# EAGLE board PCB-CMB-5-SHLD (EAGLE 7.1.0)
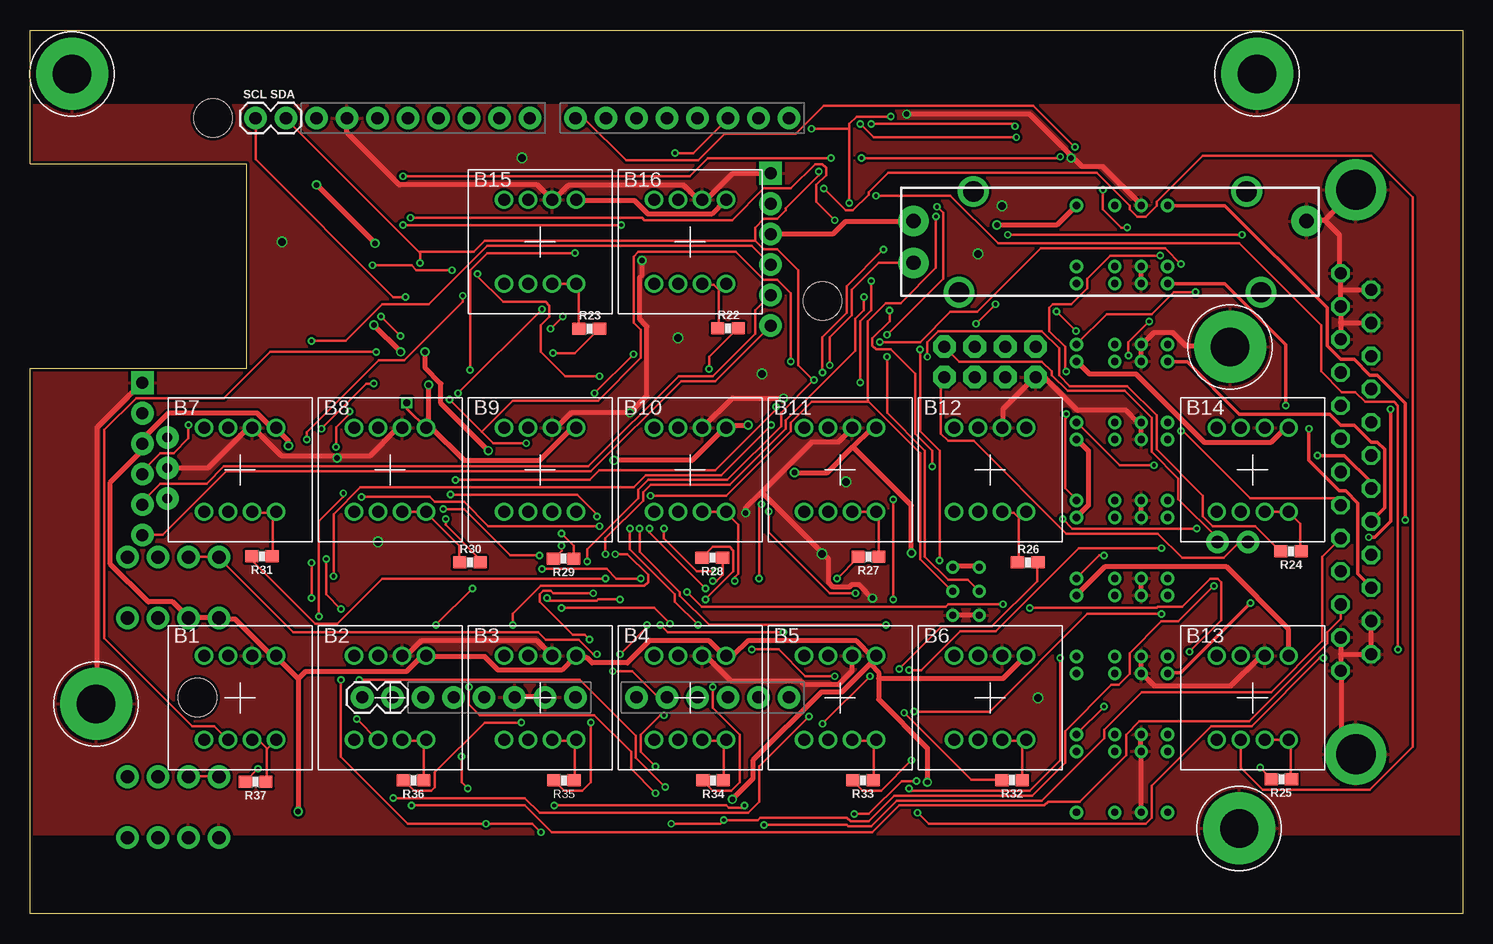
[diagram p3: board, top side]
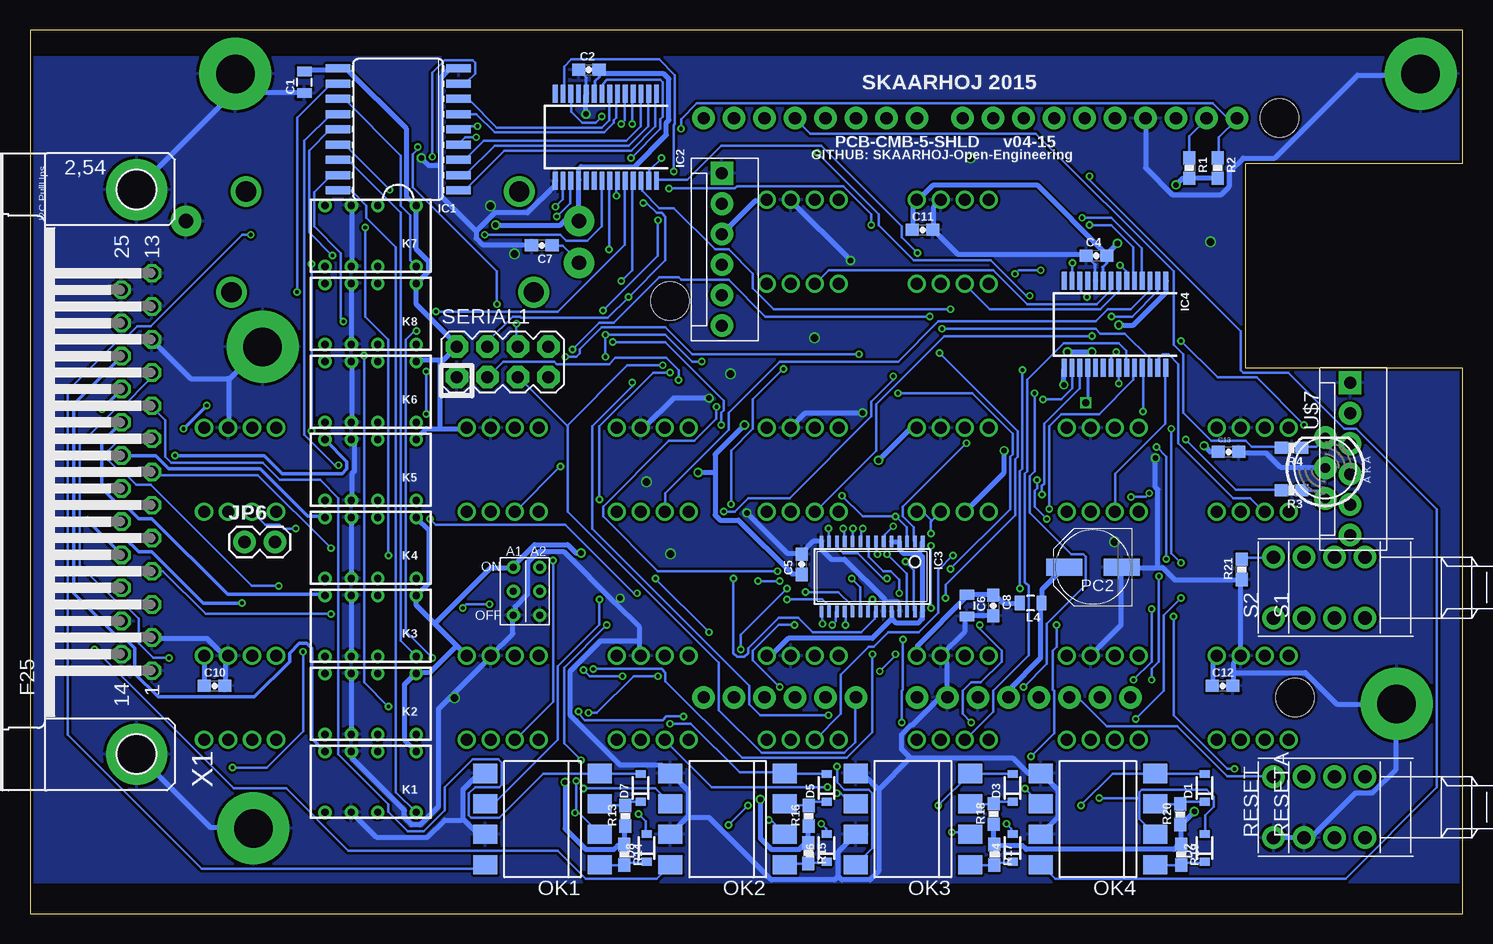
[diagram p4: board, bottom side, seen from below]

Size 119.38 x 73.66 mm. Coordinates in mm from the lower left corner, seen from the top.
Outline: 0,0 0,45.47 18.05,45.47 18.05,62.5 0,62.5 0,73.66 119.38,73.66 119.38,0 0,0
Copper layers (1*16): Top 0.035mm / dielectric 1.5mm / Bottom 0.035mm
Design rules "Fusion_eagle_rule_v1.1": minimum track width 6mil, minimum drill 12mil, track to track 6mil, track to pad 6mil, pad to pad 6mil, via to via 6mil, smd to smd 0mil, copper to edge 10mil, drill to drill 10mil, minimum pad ring 10mil, minimum via ring 6mil, stop-mask expansion 2mil, vias tented up to drill 100mil, thermal gap 10mil
Net classes: 0 default: width 0.203 mm, drill 0.305 mm, clearance 0.203 mm; 1 Power: width 0.406 mm, drill 0.457 mm, clearance 0.203 mm; 2 RELAY LINES: width 0.305 mm, drill 0.305 mm, clearance 0.203 mm; 3 INput lines: width 0.203 mm, drill 0.305 mm, clearance 0.203 mm
Holes 3.2 mm at 66.04,51.07 15.24,66.31 13.97,18.05
tRestrict: area 0,0 to 120,6.5; area 0,67.5 to 120,74
bRestrict: area 0,71.5 to 120,74; area 0,0 to 120,2.5

## Footprints (pad centres in the part's own frame; a part is rotated, then mirrored left to right if it is on the bottom)
NKK-NP01 = drill 1: 1 1,3.5; 2 -1,-3.5; L1 3,-3.5; L2 1,-3.5; L3 -1,3.5; L4 -3,3.5; LC1 3,3.5; LC2 -3,-3.5
0805 = smd 0.8 x 1.2: 1 -0.9,0; 2 0.9,0
0603-CAP = smd 1.1 x 1: 1 -0.85,0; 2 0.85,0
SOD-323 = smd 0.63 x 0.83: 1 -1.15,0; 2 1.15,0
DUEMILANOVE_VIAS = drill 1.016 pad 1.88: 3.3V 50.8,13.97; 5V 50.8,16.51; A0 50.8,29.21; A1 50.8,31.75; A2 50.8,34.29; A3 50.8,36.83; A4 50.8,39.37; A5 50.8,41.91; AREF 2.54,2.54; D2 2.54,36.83; D3 2.54,34.29; D4 2.54,31.75; D5 2.54,29.21; D6 2.54,26.67; D7 2.54,24.13; D8 2.54,20.32; D9 2.54,17.78; D10 2.54,15.24; D11 2.54,12.7; D12 2.54,10.16; D13 2.54,7.62; GND@0 50.8,19.05; GND@1 50.8,21.59; GND@2 2.54,5.08; RES 50.8,11.43; RX 2.54,41.91; TX 2.54,39.37; VIN 50.8,24.13
SO18W = smd 0.66 x 2.032: 1 -5.08,-5.029; 2 -3.81,-5.029; 3 -2.54,-5.029; 4 -1.27,-5.029; 5 0,-5.029; 6 1.27,-5.029; 7 2.54,-5.029; 8 3.81,-5.029; 9 5.08,-5.029; 10 5.08,5.029; 11 3.81,5.029; 12 2.54,5.029; 13 1.27,5.029; 14 0,5.029; 15 -1.27,5.029; 16 -2.54,5.029; 17 -3.81,5.029; 18 -5.08,5.029
SSOP28 = smd 0.4 x 1.5: 1 -4.225,-3.625; 2 -3.575,-3.625; 3 -2.925,-3.625; 4 -2.275,-3.625; 5 -1.625,-3.625; 6 -0.975,-3.625; 7 -0.325,-3.625; 8 0.325,-3.625; 9 0.975,-3.625; 10 1.625,-3.625; 11 2.275,-3.625; 12 2.925,-3.625; 13 3.575,-3.625; 14 4.225,-3.625; 15 4.225,3.625; 16 3.575,3.625; 17 2.925,3.625; 18 2.275,3.625; 19 1.625,3.625; 20 0.975,3.625; 21 0.325,3.625; 22 -0.325,3.625; 23 -0.975,3.625; 24 -1.625,3.625; 25 -2.275,3.625; 26 -2.925,3.625; 27 -3.575,3.625; 28 -4.225,3.625
TSSOP28 = smd 0.305 x 0.991: 1 -4.225,-2.918; 2 -3.575,-2.918; 3 -2.925,-2.918; 4 -2.275,-2.918; 5 -1.625,-2.918; 6 -0.975,-2.918; 7 -0.325,-2.918; 8 0.325,-2.918; 9 0.975,-2.918; 10 1.625,-2.918; 11 2.275,-2.918; 12 2.925,-2.918; 13 3.575,-2.918; 14 4.225,-2.918; 15 4.225,2.918; 16 3.575,2.918; 17 2.925,2.918; 18 2.275,2.918; 19 1.625,2.918; 20 0.975,2.918; 21 0.325,2.918; 22 -0.325,2.918; 23 -0.975,2.918; 24 -1.625,2.918; 25 -2.275,2.918; 26 -2.925,2.918; 27 -3.575,2.918; 28 -4.225,2.918
1X02 = drill 1.016 pad 1.88: 1 0,0; 2 2.54,0
MOLEX-1X6 = drill 1.016 pad 1.88 square: 1 0,0 | drill 1.016 pad 1.88: 2 2.54,0; 3 5.08,0; 4 7.62,0; 5 10.16,0; 6 12.7,0
DS2Y = drill 0.6: 1 1.2,0.46; 16 1.2,5.54; O1 4.4,0.46; O2 4.4,5.54; P1 6.6,0.46; P2 6.6,5.54; S1 8.8,0.46; S2 8.8,5.54
DIL8-SMD = smd 1.6 x 2: 1 -3.81,-4.77; 2 -1.27,-4.77; 3 1.27,-4.77; 4 3.81,-4.77; 5 3.81,4.77; 6 1.27,4.77; 7 -1.27,4.77; 8 -3.81,4.77
PANASONIC_D = smd 3 x 1.4: + 2.4,0; - -2.4,0
SLIDER20 = drill 1.194 pad 2.54: 1 -16.383,1.74; 2A -16.383,-1.74; 3 16.383,1.74 | drill 1.702: P$1 -11.392,4.191; P$2 11.392,4.191; P$3 12.598,-4.191; P$4 -12.598,-4.191
0603-RES = smd 1.1 x 1: 1 -0.85,0; 2 0.85,0
PUSHBUTTON = drill 1.1 pad 1.88: 1 2.54,2.54; 2 2.54,-2.54; 3 -2.54,2.54; 4 -2.54,-2.54
2X4 = drill 1.016 pad 1.88 octagon: 1 -3.81,-1.27; 2 -3.81,1.27; 3 -1.27,-1.27; 4 -1.27,1.27; 5 1.27,-1.27; 6 1.27,1.27; 7 3.81,-1.27; 8 3.81,1.27
3.2MMPAD6MM = drill 3.2 pad 6: P$1 0,0
LED5MM-BICOLOR = drill 0.813 pad 1.88: A2 2.54,0; A3 -2.54,0; K1 0,0
2BITADDR = drill 0.6: A1 0,0; A2 2.2,0; H2 0,2; H3 2.2,2; L2 0,-2; L3 2.2,-2
F25HP = drill 1.016 octagon: 1 -16.561,-1.27; 2 -13.792,-1.27; 3 -11.049,-1.27; 4 -8.28,-1.27; 5 -5.512,-1.27; 6 -2.769,-1.27; 7 0,-1.27; 8 2.769,-1.27; 9 5.512,-1.27; 10 8.28,-1.27; 11 11.049,-1.27; 12 13.792,-1.27; 13 16.561,-1.27; 14 -15.189,1.27; 15 -12.421,1.27; 16 -9.652,1.27; 17 -6.909,1.27; 18 -4.14,1.27; 19 -1.372,1.27; 20 1.372,1.27; 21 4.14,1.27; 22 6.909,1.27; 23 9.652,1.27; 24 12.421,1.27; 25 15.189,1.27 | drill 3.302 pad 5.08: G1 -23.52,0; G2 23.52,0

## Placement (x,y rotation side)
B1  NKK-NP01-SINGLECOLOR  [NKK-NP01]  17.5,18 0 top
B2  NKK-NP01-SINGLECOLOR  [NKK-NP01]  30,18 0 top
B3  NKK-NP01-SINGLECOLOR  [NKK-NP01]  42.5,18 0 top
B4  NKK-NP01-SINGLECOLOR  [NKK-NP01]  55,18 0 top
B5  NKK-NP01-SINGLECOLOR  [NKK-NP01]  67.5,18 0 top
B6  NKK-NP01-SINGLECOLOR  [NKK-NP01]  80,18 0 top
B7  NKK-NP01-SINGLECOLOR  [NKK-NP01]  17.5,37 0 top
B8  NKK-NP01-SINGLECOLOR  [NKK-NP01]  30,37 0 top
B9  NKK-NP01-SINGLECOLOR  [NKK-NP01]  42.5,37 0 top
B10  NKK-NP01-SINGLECOLOR  [NKK-NP01]  55,37 0 top
B11  NKK-NP01-SINGLECOLOR  [NKK-NP01]  67.5,37 0 top
B12  NKK-NP01-SINGLECOLOR  [NKK-NP01]  80,37 0 top
B13  NKK-NP01-SINGLECOLOR  [NKK-NP01]  101.88,18 0 top
B14  NKK-NP01-SINGLECOLOR  [NKK-NP01]  101.88,37 0 top
B15  NKK-NP01-SINGLECOLOR  [NKK-NP01]  42.5,56 0 top
B16  NKK-NP01-SINGLECOLOR  [NKK-NP01]  55,56 0 top
C1  100nF  [0805]  96.52,69.31 90 bottom
C2  100nF  [0603-CAP]  72.81,70.35 0 bottom
C4  100nF  [0603-CAP]  30.51,54.86 0 bottom
C5  100nF  [0603-CAP]  55.07,29.13 90 bottom
C6  22uF  [0805]  41.3,25.7 270 bottom
C7  10nF  [0603-CAP]  76.73,55.71 180 bottom
C8  100nF  [0603-CAP]  39.1,25.7 270 bottom
C10  100nF  [0603-CAP]  104,19 0 bottom
C11  100nF  [0603-CAP]  45,57 0 bottom
C12  100nF  [0603-CAP]  20,19 0 bottom
C13  100nF  [0603-CAP]  19.5,38.5 0 bottom
D1  1N4148  [SOD-323]  21.5,10.5 90 bottom
D2  1N4148  [SOD-323]  21.5,5.5 90 bottom
D3  1N4148  [SOD-323]  37.5,10.5 90 bottom
D4  1N4148  [SOD-323]  37.5,5.5 90 bottom
D5  1N4148  [SOD-323]  53,10.5 90 bottom
D6  1N4148  [SOD-323]  53,5.5 90 bottom
D7  1N4148  [SOD-323]  68.5,10.5 90 bottom
D8  1N4148  [SOD-323]  68,5.5 90 bottom
GND  ARDUINO_SHIELDNO_SILK  [DUEMILANOVE_VIAS]  21.34,68.85 270 top
IC1  ULN2803A  [SO18W]  88.7,65.38 90 bottom
IC2  MCP23017SS  [SSOP28]  71.39,64.73 180 bottom
IC3  PCA9685  [TSSOP28]  49.21,28.12 180 bottom
IC4  MCP23017SS  [SSOP28]  28.97,49.12 180 bottom
JP1  [1X02]  27.69,18.05 0 top
JP3  [MOLEX-1X6]  61.72,61.72 270 bottom
JP4  [1X02]  21.34,66.31 180 top
JP5  [MOLEX-1X6]  9.36,44.26 270 bottom
JP6  [1X02]  101.5,31 0 bottom
K1  RELAY5VIM03  [DS2Y]  86,14 180 bottom
K2  RELAY5VIM03  [DS2Y]  86,20.5 180 bottom
K3  RELAY5VIM03  [DS2Y]  86,27 180 bottom
K4  RELAY5VIM03  [DS2Y]  86,33.5 180 bottom
K5  RELAY5VIM03  [DS2Y]  86,40 180 bottom
K6  RELAY5VIM03  [DS2Y]  86,46.5 180 bottom
K7  RELAY5VIM03  [DS2Y]  86,59.5 180 bottom
K8  RELAY5VIM03  [DS2Y]  86,53 180 bottom
L4  ILHB0805ER121V  [0805]  36,25.9 180 bottom
OK1  LTV826S  [DIL8-SMD]  76.67,7.9 90 bottom
OK2  LTV826S  [DIL8-SMD]  61.24,7.9 90 bottom
OK3  LTV826S  [DIL8-SMD]  45.81,7.9 90 bottom
OK4  LTV826S  [DIL8-SMD]  30.38,7.9 90 bottom
PC2  47u  [PANASONIC_D]  30.8,28.9 180 bottom
POT1  10K Linear  [SLIDER20]  90,56 0 top
R1  1K5  [0603-RES]  22.77,62.15 270 bottom
R2  1K5  [0603-RES]  20.4,62.15 270 bottom
R3  270  [0603-RES]  14.24,35.29 180 bottom
R4  270  [0603-RES]  14.24,38.83 180 bottom
R13  330R  [0603-RES]  69.76,8.18 90 bottom
R14  330R  [0603-RES]  69.86,4.93 270 bottom
R15  330R  [0603-RES]  54.53,5.06 270 bottom
R16  330R  [0603-RES]  54.47,8.18 90 bottom
R17  330R  [0603-RES]  39.03,4.93 270 bottom
R18  330R  [0603-RES]  39.06,8.32 90 bottom
R19  330R  [0603-RES]  23.46,4.93 270 bottom
R20  330R  [0603-RES]  23.52,8.3 90 bottom
R21  10K  [0603-RES]  18.41,28.72 90 bottom
R22  100R  [0603-RES]  58.16,48.8 0 top
R23  100R  [0603-RES]  46.61,48.77 0 top
R24  100R  [0603-RES]  105.09,30.23 180 top
R25  100R  [0603-RES]  104.28,11.23 180 top
R26  100R  [0603-RES]  83.15,29.29 0 top
R27  100R  [0603-RES]  69.88,29.75 180 top
R28  100R  [0603-RES]  56.86,29.68 180 top
R29  100R  [0603-RES]  44.47,29.61 180 top
R30  100R  [0603-RES]  36.66,29.3 0 top
R31  100R  [0603-RES]  19.32,29.8 180 top
R32  100R  [0603-RES]  81.84,11.16 180 top
R33  100R  [0603-RES]  69.41,11.14 180 top
R34  100R  [0603-RES]  56.93,11.12 180 top
R35  100R  [0603-RES]  44.48,11.12 180 top
R36  100R  [0603-RES]  31.96,11.12 180 top
R37  100R  [0603-RES]  18.81,11 180 top
RESET  [PUSHBUTTON]  13.21,8.89 90 bottom
RESETA  [PUSHBUTTON]  10.67,8.89 90 bottom
S1  [PUSHBUTTON]  10.67,27.19 90 bottom
S2  [PUSHBUTTON]  13.21,27.19 90 bottom
SERIAL1  M04X2  [2X4]  80,46 0 bottom
U$4  GNDPAD6MM  [3.2MMPAD6MM]  100,47.25 0 top
U$7  LEDBICOLOR-AKA  [LED5MM-BICOLOR]  11.44,37.16 90 bottom
U$15  GNDPAD6MM  [3.2MMPAD6MM]  100.77,7.12 0 top
U$18  GNDPAD6MM  [3.2MMPAD6MM]  102.26,70 0 top
U$19  2BITADDR  [2BITADDR]  79.1,26.89 0 bottom
U$20  GNDPAD6MM  [3.2MMPAD6MM]  5.5,17.5 0 top
U$21  GNDPAD6MM  [3.2MMPAD6MM]  3.5,70 0 top
X1  DB25F  [F25HP]  110.49,36.83 90 bottom

## Tracks (layer width: path | path; a pad name or v marks a point on that pad's centre or on a via)
5V  (via drill 0.46, 0.6)
  Top 0.254: v31.4,42.6 31.4,42.1 B8.LC1
  Top 0.406: v21.54,39.01 21.54,39.42 20.52,40.44 B7.LC1 20.32,40.54 20.12,40.54 18.9,41.76 11.58,41.76 9.45,39.62 9.45,39.22 JP5.3 9.25,39.01 9.25,38.51 6.71,35.97 6.71,29.16 9.86,26.01 11.89,26.01 13.11,24.79 S1.3 13.21,24.69 15.65,24.69 S2.3 15.75,24.59 17.07,24.59 20.12,21.54 20.42,21.54 B1.LC1 20.62,21.34 22.35,19.61 | 22.35,19.61 v22.35,8.53 | 22.35,19.61 22.96,20.22 31.39,20.22 32.61,21.44 32.82,21.44 B2.LC1 33.02,21.44 37.9,21.44 39.01,20.32 44.3,20.32 45.41,21.44 B3.LC1 45.62,21.34 46.43,21.34 46.84,20.93 49.78,20.93 51.61,22.76 56.59,22.76 57.81,21.54 B4.LC1 58.01,21.54 58.62,21.54 59.84,22.76 68.89,22.76 70.21,21.44 B5.LC1 70.41,21.44 70.41,21.23 70,20.83 | v28.75,55.88 v23.88,60.76 | B15.LC1 45.52,59.44 50.39,59.44 51.51,58.32 56.79,58.32 57.91,59.44 B16.LC1 | POT1.1 73.56,57.71 67.97,57.71 66.95,56.69 61.77,56.69 JP3.3 | v33.22,44.09 33.22,40.74 33.02,40.54 B8.LC1 33.33,40.64 36.17,37.8 42.47,37.8 45.11,40.44 45.41,40.44 B9.LC1 | v59.84,40.74 58.22,40.74 58.01,40.54 B10.LC1 57.81,40.44 55.17,37.8 v48.67,37.8 | 68.58,38.91 66.45,36.78 v63.7,36.78 | 68.58,38.91 70.1,40.44 70.41,40.44 B11.LC1 | v58.52,9.55 60.25,11.28 60.25,12.8 65.94,18.49 67.67,18.49 70,20.83 | v74.78,10.97 74.78,13.82 70.71,17.88 70.71,19.61 | 70.71,19.61 70.71,20.12 70,20.83 | U$19.H3 76.91,28.96 79.05,28.96 U$19.H2 | B13.LC1 104.85,21.54 104.85,23.77 99.67,28.96 89.61,28.96 87.27,26.62 K3.1 | K4.1 87.27,33.12 88.19,34.04 88.19,38.61 87.27,39.52 K5.1 | B14.LC1 104.85,40.44 104.55,40.44 103.43,39.32 97.84,39.32 92.15,45.01 88.29,45.01 87.27,46.02 K6.1 | 70.71,19.61 81.08,19.61 82.91,21.44 B6.LC1
  Top 0.406: 68.58,38.91 73.46,34.04 v73.46,30.07 | v80.57,57.4 85.55,57.4 87.17,59.03 K7.1
  Bottom 0.254: C2.2 71.96,69.74 72.3,69.4 72.3,68.42 IC2.9 | C4.2 29.66,54.24 30,53.9 30,52.8 IC4.9 | IC4.18 31.25,42.76 v31.4,42.6
  Bottom 0.406: L4.2 36.98,25.91 38.3,25.91 38.91,26.52 C8.1 39.12,26.62 41.25,26.62 C6.1 41.35,26.42 45.41,22.35 45.41,21.54 B3.LC1 | v21.54,39.01 21.03,38.51 20.42,38.51 C13.1 | R18.1 39.12,7.42 39.12,5.79 R17.1 38.91,5.69 36.68,5.69 36.37,5.38 24.08,5.38 23.67,5.79 R19.1 23.47,5.79 23.47,7.42 R20.1 23.37,7.52 v22.35,8.53 | C12.1 20.83,19.1 20.83,21.13 20.52,21.44 B1.LC1 | C2.2 71.93,70 66.55,70 66.14,69.6 66.14,66.14 66.34,65.94 66.34,64.92 68.99,62.28 73.46,62.28 73.66,62.08 73.66,61.27 IC2.18 73.66,61.06 73.66,57.81 POT1.1 73.86,57.81 74.78,57.81 75.18,57.4 v80.57,57.4 | R2.2 20.42,61.37 22.76,61.37 R1.2 22.96,61.27 23.37,61.27 v23.88,60.76 | v28.75,55.88 29.67,54.97 C4.2 29.77,55.07 35.46,60.76 44.09,60.76 45.31,59.54 B15.LC1 45.52,59.44 45.82,59.13 45.82,57.1 C11.1 | JP3.3 58.93,59.44 58.01,59.44 B16.LC1 | v33.22,44.09 33.22,45.41 IC4.15 | 62.28,36.78 62.28,38.3 v59.84,40.74 | 62.28,36.78 62.28,33.22 61.87,32.82 60.35,32.82 55.88,28.35 55.17,28.35 C5.1 | 62.28,36.78 v63.7,36.78 | v48.67,37.8 46.02,40.44 45.52,40.44 B9.LC1 | 47.55,24.59 47.24,24.28 45.31,24.28 45.01,24.59 45.01,25.2 IC3.28 45.01,25.4 45.01,29.77 45.31,30.07 | 47.55,24.59 47.55,25.2 IC3.24 | 45.31,30.07 45.01,30.38 45.01,30.99 IC3.1 | 45.31,30.07 46.63,30.07 46.94,30.38 46.94,30.99 | 46.94,30.99 IC3.4 | 46.94,30.99 47.55,30.99 IC3.5 | 47.55,24.59 49.17,22.96 56.19,22.96 57.61,21.54 57.91,21.54 B4.LC1 | R13.1 69.8,7.32 69.8,5.79 R14.1 70,5.69 70.41,5.69 70.71,5.38 73.05,5.38 74.78,7.11 v74.78,10.97 | R16.1 54.56,7.32 54.56,5.99 R15.1 54.66,5.79 54.86,5.79 55.27,5.38 57.61,5.38 58.52,6.3 v58.52,9.55
  Bottom 0.406: K1.1 88.19,14.53 88.19,19.1 87.27,20.02 K2.1 87.07,20.12 86.06,20.12 83.82,22.35 | C10.1 104.85,19.1 104.85,21.44 B13.LC1 | 83.82,22.35 83.01,21.54 B6.LC1 | 83.82,22.35 85.65,24.18 | 85.65,24.18 87.17,25.7 87.17,26.52 K3.1 87.07,26.62 86.16,27.53 86.16,32 87.17,33.02 K4.1 | 85.65,24.18 80.97,28.85 79.15,28.85 U$19.H2 79.05,29.06 77.32,30.79 74.57,30.79 73.86,30.07 v73.46,30.07 | 85.24,40.44 86.36,40.44 87.17,39.62 K5.1 | 85.24,40.44 83.01,40.44 B12.LC1 | C1.2 96.52,70.31 93.88,70.31 93.78,70.41 IC1.10 93.57,70.41 92.96,70.41 87.99,65.43 87.99,59.74 87.38,59.13 K7.1 87.17,59.03 87.17,55.37 86.16,54.36 86.16,53.54 87.07,52.63 K8.1 87.17,52.53 87.17,50.8 83.82,47.45 SERIAL1.2 83.82,47.24 84.94,46.13 85.24,46.13 | 85.24,46.13 87.17,46.13 K6.1 | 85.24,46.13 85.24,40.44
A1  (via drill 0.3)
  Top 0.203: v41.35,39.22 38.61,39.22 37.64,40.18 | v34.95,42.88 37.64,40.18 | v75.59,58.93 76.1,58.42 76.1,52.93 v71.42,48.26 | v71.42,46.43 71.42,41.76 74.57,38.61 74.57,29.77 76.5,27.84 78.13,27.84 79.05,26.92 U$19.A1 | 37.64,40.18 40.23,42.77 47.35,42.77 50.9,46.33 50.9,48.67 50.29,49.28 50.29,54.76 50.7,55.17 58.83,55.17 61.16,52.83 62.28,52.83 63.4,51.71 v63.4,46.02
  Bottom 0.203: v41.35,39.22 46.63,33.93 46.63,33.12 45.72,32.21 45.72,31.09 IC3.2 | v34.95,42.88 33.43,42.88 32.51,43.79 32.51,45.41 IC4.16 | v75.59,58.93 74.98,59.54 74.98,61.06 IC2.16 | v71.42,46.43 v71.42,48.26 66.45,48.26 64.21,46.02 v63.4,46.02
A1CFG  (via drill 0.3)
  Top 0.203: S1.1 13.21,29.77 15.75,29.77 S2.1 15.75,29.67 21.95,23.47 42.37,23.47 42.98,22.86 45.72,22.86 46.94,21.64 v47.24,21.64 | v48.56,20.22 50.19,20.22 52.32,18.09 53.03,18.09 GND.A1
  Bottom 0.203: R21.2 18.39,29.67 15.75,29.67 S2.1 | v48.56,20.22 47.24,21.54 v47.24,21.64
A2  (via drill 0.3)
  Top 0.203: v47.24,33.12 47.24,33.33 45.62,34.95 v35.05,34.95 | v75.49,58.12 75.49,53.85 72.54,50.9 71.32,50.9 69.8,49.38 69.8,42.77 69.85,42.72 | 69.85,42.72 74.17,38.41 74.17,29.57 76.81,26.92 U$19.A2 | v51.71,34.85 58.01,34.85 63.4,40.23 63.4,40.95 65.13,42.67 69.8,42.67 69.85,42.72
  Bottom 0.203: v35.05,34.95 35.05,35.66 34.85,35.87 34.85,40.84 31.9,43.79 31.9,45.41 IC4.17 | IC3.3 46.33,31.09 46.33,32.21 v47.24,33.12 49.99,33.12 v51.71,34.85 | v75.49,58.12 74.37,59.23 74.37,61.06 IC2.17
ARD_5V
  Bottom 0.406: PC2.+ 33.22,28.85 35.05,27.03 35.05,25.91 L4.1 35.15,25.7 35.15,21.34 37.8,18.69 37.8,18.09 GND.5V
D2  (via drill 0.3)
  Top 0.203: v23.06,39.52 23.06,40.13 29.06,46.13 31.19,46.13 36.07,51 v36.07,51.51 | v53.75,63.4 55.27,63.4 58.12,66.24 GND.D2
  Bottom 0.203: v23.06,39.52 18.9,35.36 15.14,35.36 R3.2 | v36.07,51.51 36.37,51.51 39.32,54.46 45.72,54.46 48.67,57.4 48.67,58.32 v53.75,63.4
D3
  Bottom 0.203: R4.2 15.14,38.91 17.58,38.91 18.09,39.42 20.93,39.42 23.27,41.76 23.27,46.63 24.08,47.45 24.08,53.54 35.56,65.02 54.36,65.02 55.58,66.24 GND.D3
DISP_DATA_OUT  (via drill 0.3)
  Top 0.203: v87.07,63.91 83.62,67.36 66.14,67.36 63.8,65.02 57.91,65.02 55.68,62.79 49.68,62.79 46.23,66.24 45.52,66.24 GND.D7 | v78.84,49.17 v80.47,50.8
  Bottom 0.203: v87.07,63.91 87.07,63.7 87.48,63.3 87.48,60.55 80.47,53.54 v80.47,50.8 | v78.84,49.17 78.84,47.45 78.74,47.35 SERIAL1.6
GND  (via drill 0.46, 0.6)
  Top 0.406: 109.22,49.28 X1.12 109.22,52.02 | 109.22,49.28 X1.11 | 109.22,52.02 X1.13 109.12,53.54 109.12,56.59 107.9,57.81 | 109.22,49.28 111.76,49.28 X1.24 | 109.22,52.02 X1.25 | 107.9,57.81 106.48,57.81 POT1.3 | 107.9,57.81 110.44,60.35 X1.G2 | X1.2 109.22,21.64 | 109.22,21.64 X1.1 109.32,20.12 109.32,14.43 110.44,13.31 X1.G1 | 109.22,21.64 X1.14 X1.15 | K4.P1 92.56,33.12 92.56,34.44 K5.P2 | K3.P1 92.56,26.62 92.56,27.94 K4.P2 | K3.P2 92.56,21.44 92.56,20.12 K2.P1 92.76,19.91 93.67,19 100.08,19 102.51,21.44 102.82,21.44 B13.1 | K1.P2 92.56,8.53 92.56,13.51 K1.P1 92.56,13.72 92.56,14.94 K2.P2 | B12.1 81.08,40.54 81.08,42.06 83.72,44.7 SERIAL1.1 84.02,44.7 84.53,44.7 87.27,41.96 91.34,41.96 92.35,40.95 K6.P2 92.56,40.95 92.56,39.62 K5.P1 | K8.P1 92.56,52.63 92.56,53.95 K7.P2 | K6.P1 92.56,46.13 92.56,47.45 K8.P2 92.76,47.55 93.67,48.46 95.2,48.46 96.32,47.35 99.97,47.35 U$4.P$1 | v73.05,66.65 83.31,66.65 86.87,63.09 | 86.87,63.09 87.68,62.28 89.41,62.28 92.56,59.13 K7.P1 | v86.77,62.99 86.87,63.09 | JP3.1 61.67,61.67 58.52,61.67 56.39,59.54 56.08,59.54 B16.1 55.88,59.64 55.58,59.64 54.46,60.76 44.91,60.76 43.69,59.54 B15.1 43.48,59.54 42.27,60.76 30.79,60.76 26.42,65.13 GND.GND@2 | JP5.1 9.35,44.2 8.64,43.48 8.53,43.48 5.59,40.54 5.59,17.58 U$20.P$1 | B9.1 43.59,40.54 43.89,40.54 45.11,41.76 v49.99,41.76 51.41,43.18 51.41,48.97 50.8,49.58 50.8,53.03 51,53.24 v51,54.46 | v62.79,42.98 58.52,42.98 56.08,40.54 B10.1 | v59.64,33.43 59.64,33.83 60.96,35.15 | 60.96,35.15 65.13,39.32 67.36,39.32 68.48,40.44 B11.1 | U$19.L3 76.91,24.89 79.05,24.89 U$19.L2 | B4.1 56.08,21.44 56.39,21.44 58.42,19.41 64.21,19.41 64.52,19.1 67.36,19.1 68.48,20.22 68.48,21.44 B5.1
  Top 0.406: U$7.K1 11.48,37.19 14.83,37.19 18.09,40.44 18.49,40.44 B7.1 18.69,40.44 20.93,38.2 25.6,38.2 | 25.6,38.2 28.35,38.2 30.58,40.44 30.99,40.44 B8.1 | GND.GND@0 40.44,18.09 42.88,18.09 GND.GND@1 | B2.1 31.09,21.54 31.39,21.54 32.61,22.76 42.27,22.76 43.48,21.54 B3.1 | v25.6,38 25.6,38.2 | 60.96,35.15 66.55,29.57 66.55,27.64 66.95,27.23 68.28,27.23 68.48,27.43 69.09,27.43 v70.21,26.31
  Bottom 0.254: IC2.10 73.02,69.7 C2.1 | IC4.10 30.59,54.09 C4.1 | IC3.23 48.23,25.96 48.1,26.1 47.1,26.1 47,26 47,25.27 IC3.25
  Bottom 0.406: 102.82,44.5 102.82,40.54 B14.1 | 102.82,44.5 100.08,47.24 U$4.P$1 | C1.1 96.52,68.48 100.79,68.48 102.21,69.9 U$18.P$1 101.7,69.19 110.54,60.35 X1.G2 | 102.82,44.5 102.92,44.6 105.97,44.6 109.22,47.85 X1.11 | C10.2 103.12,19.1 103.12,21.23 102.92,21.44 B13.1 103.12,21.44 104.65,22.96 109.22,22.96 X1.2 | U$15.P$1 100.79,7.21 104.34,7.21 110.44,13.31 X1.G1 | 83.31,7.92 82.09,6.71 81.48,6.71 OK1.7 | 83.31,7.92 83.31,10.36 81.99,11.68 81.48,11.68 OK1.5 | K2.P1 92.56,20.02 92.56,15.04 K2.P2 | K3.P1 92.56,26.52 92.56,21.54 K3.P2 | K4.P1 92.56,33.02 92.56,28.04 K4.P2 | 83.31,7.92 83.41,7.82 84.84,7.82 86.26,6.4 90.53,6.4 92.56,8.43 K1.P2 | K6.P2 92.56,41.05 92.56,46.02 K6.P1 | K8.P1 92.56,52.53 92.56,47.55 K8.P2 | 82.19,56.9 82.19,56.29 81.69,55.78 77.62,55.78 C7.2 | 82.19,56.9 80.67,58.42 77.93,58.42 75.69,60.66 75.69,61.06 IC2.15 | 85.14,62.38 85.14,59.84 82.19,56.9 | 85.14,62.38 85.14,69.7 84.43,70.41 83.72,70.41 IC1.9 | v73.05,66.65 73.05,68.28 IC2.10 | 85.14,62.38 86.16,62.38 v86.77,62.99 | K7.P2 92.56,54.05 92.56,59.03 K7.P1 | K5.P2 92.56,34.54 92.56,36.68 92.35,36.88 92.35,39.32 92.56,39.52 K5.P1 | B15.1 43.59,59.44 44.09,58.93 44.09,57.1 C11.2 43.99,56.9 42.06,54.97 31.39,54.97 C4.1 | GND.GND@2 26.42,62.18 24.18,59.94 20.12,59.94 19.41,60.66 19.41,61.87 18.29,62.99 15.65,62.99 8.74,69.9 3.56,69.9 U$21.P$1 | RESET.3 15.75,6.4 13.21,6.4 RESETA.3 13.11,6.5 12.5,6.5 8.94,10.06 7.52,10.06 5.59,11.99 5.59,17.48 U$20.P$1 5.79,17.48 10.46,17.48 13.11,20.12 19.1,20.12 | 48.1,26.1 48.16,26.21 51.51,29.57 52.63,29.57 53.44,30.38 53.44,30.89 IC3.14 53.44,31.09 54.05,31.09 55.07,30.07 C5.2 55.27,30.07 56.29,30.07 v59.64,33.43
  Bottom 0.406: v49.99,41.76 54.76,41.76 55.98,40.54 B10.1 | v62.79,42.98 65.73,42.98 68.17,40.54 68.48,40.54 B11.1 | 70.61,25.91 68.58,23.88 68.58,22.76 | 70.61,25.91 74.88,30.18 77.01,30.18 77.93,29.26 77.93,26.62 78.94,25.6 78.94,24.99 U$19.L2 79.15,24.79 79.15,23.37 80.97,21.54 B6.1 81.08,21.34 85.34,17.07 85.34,8.94 86.87,7.42 87.58,7.42 88.19,8.03 88.19,8.64 92.56,13.01 92.56,13.51 K1.P1 | 68.58,22.76 68.58,21.54 B5.1 | C13.2 18.59,38.41 16.36,38.41 15.14,37.19 11.48,37.19 U$7.K1 | 19.1,20.12 19.1,20.93 18.59,21.44 B1.1 18.49,21.64 18.49,27.84 R21.1 18.69,27.84 23.98,27.84 24.99,28.85 25.4,28.85 | 19.1,20.12 19.1,19.1 C12.2 | B2.1 30.99,21.54 28.45,24.08 28.45,28.85 PC2.- 28.25,28.85 25.4,28.85 | C8.2 39.12,24.89 41.25,24.89 C6.2 41.45,24.69 41.45,23.57 43.48,21.54 B3.1 43.38,21.34 42.98,20.93 42.98,18.09 GND.GND@1 43.18,18.09 43.48,18.09 45.82,15.75 45.92,15.75 46.74,14.94 46.74,13.72 46.02,13.01 | 64.52,8.13 65.94,6.71 OK2.7 | 64.52,8.13 64.52,10.26 65.94,11.68 OK2.5 66.14,11.79 66.75,12.39 70.21,12.39 74.37,16.56 74.37,20.22 71.83,22.76 68.58,22.76 | OK4.7 35.05,6.71 33.73,8.03 33.73,10.36 35.05,11.68 OK4.5 35.36,11.68 36.17,11.68 37.49,13.01 46.02,13.01 | 52.02,3.15 52.02,5.18 50.6,6.6 OK3.7 | 52.02,3.15 51.71,2.85 49.38,2.85 48.67,3.56 48.67,10.36 | 48.67,10.36 49.99,11.68 50.49,11.68 OK3.5 | 48.67,10.36 46.02,13.01 | 52.02,3.15 52.32,2.85 57.61,2.85 62.79,8.03 64.41,8.03 64.52,8.13 | v25.6,38 25.6,35.56 25.4,35.36 25.4,28.85 | 70.61,25.91 v70.21,26.31 | v51,54.46 55.98,59.44 B16.1
  other vias: 29,31 21,56 41,63 54,48 61,45 68,36 66,30 84,18 79,55 81,59
  pour Bottom: 0,0 120,0 120,74 0,74
  pour Top: 0,0 120,0 120,74 0,74
GPA0  (via drill 0.3)
  Top 0.203: v28.85,46.84 20.02,46.84 16.15,42.98 8.84,42.98 6.2,40.34 6.2,22.96 13.51,15.65 15.34,15.65 16.46,14.53 B1.2
  Bottom 0.203: v28.85,46.84 29.26,46.43 29.26,45.52 IC4.21
GPA1  (via drill 0.3)
  Top 0.203: v28.65,44.2 28.04,44.2 v24.28,40.44 | v23.47,26.31 v23.47,29.26 | v27.23,16.26 28.96,14.53 B2.2
  Bottom 0.203: v28.65,44.2 28.65,45.41 IC4.22 | v24.28,40.44 24.28,30.07 v23.47,29.26 | v23.47,26.31 24.89,24.89 24.89,18.59 v27.23,16.26
GPA2
  Bottom 0.203: IC4.23 28.04,45.52 28.04,46.94 28.65,47.55 33.22,47.55 36.27,44.5 36.27,36.88 36.47,36.68 36.47,27.64 36.17,27.33 36.17,21.54 39.12,18.59 39.12,16.87 41.45,14.53 B3.2
GPA3  (via drill 0.3)
  Top 0.203: v34.44,33.73 36.17,33.73 40.03,29.87 v42.47,29.87
  Bottom 0.203: v34.44,33.73 34.44,40.64 33.43,41.66 30.28,41.66 27.43,44.5 27.43,45.41 IC4.24 | v42.47,29.87 43.69,28.65 43.69,25.09 45.31,23.47 47.85,23.47 49.07,22.25 49.48,22.25 51.82,19.91 51.82,16.66 53.95,14.53 B4.2
GPA4  (via drill 0.3)
  Top 0.203: v26.62,41.86 26.62,41.66 25.5,40.54 v25.5,38.91 | v24.69,29.57 24.69,26.62 v25.91,25.4 | v27.43,19.51 45.82,19.51 50.49,14.83 50.49,13.01 v52.93,10.57
  Bottom 0.203: v26.62,41.86 26.62,45.41 IC4.25 | v25.5,38.91 24.69,38.1 v24.69,29.57 | v25.91,25.4 25.91,21.03 v27.43,19.51 | v52.93,10.57 62.59,10.57 66.45,14.43 B5.2
GPA5  (via drill 0.3)
  Top 0.203: v44.4,49.78 v43.38,48.77 | v74.17,47.04 74.17,40.23 75.79,38.61 v75.79,29.46
  Bottom 0.203: v43.38,48.77 30.58,48.77 30.18,48.36 28.14,48.36 26.11,46.33 26.11,45.52 IC4.26 | v44.4,49.78 58.12,49.78 61.16,52.83 65.13,52.83 65.33,53.03 66.95,53.03 70.71,49.28 71.93,49.28 v74.17,47.04 | v75.79,29.46 75.79,17.68 78.94,14.53 B6.2
GPA6
  Bottom 0.203: IC4.27 25.3,45.52 25.3,46.33 24.99,46.63 24.49,46.63 23.67,45.82 23.67,39.22 19.1,34.65 17.68,34.65 16.56,33.53 B7.2
GPA7
  Bottom 0.203: IC4.28 24.79,45.41 24.79,40.84 28.96,36.68 28.96,33.53 B8.2
GPB0  (via drill 0.46)
  Top 0.406: v30.89,46.84 v28.65,49.07 | v32.92,46.84 32.92,45.52 34.24,44.2 34.24,42.57 v38.2,38.61
  Bottom 0.406: v28.65,49.07 27.43,49.07 24.69,51.82 24.69,52.73 IC4.1 | v32.92,46.84 v30.89,46.84 | v38.2,38.61 38.2,36.78 41.45,33.53 B9.2
GPB1  (via drill 0.3)
  Top 0.203: v30.89,48.16 v29.26,49.78
  Bottom 0.203: v29.26,49.78 27.53,49.78 25.4,51.92 IC4.2 | v30.89,48.16 43.18,48.16 48.87,42.47 48.87,38.61 53.95,33.53 B10.2
GPB2
  Bottom 0.203: IC4.3 26.11,52.73 26.11,51.92 27.64,50.39 29.57,50.39 30.58,49.38 43.69,49.38 47.04,46.02 56.9,46.02 61.16,41.76 61.16,40.34 66.45,35.05 66.45,33.53 B11.2
GPB3  (via drill 0.3)
  Top 0.203: v31.7,58.01 51,58.01 51.21,57.81 58.52,57.81 61.16,60.45 63.4,60.45 65.43,62.48 66.04,62.48 66.34,62.18 66.34,61.57 65.53,60.76 65.53,59.33 v67.06,57.81 | v71.63,50.29 71.63,49.38 70.21,47.95 70.21,47.35 70.51,47.04 71.73,47.04 73.76,45.01 73.76,40.03 75.18,38.61 v75.18,37.29
  Bottom 0.203: v31.7,58.01 29.26,58.01 26.72,55.47 26.72,52.83 IC4.4 | v67.06,57.81 67.06,54.86 v71.63,50.29 | v75.18,37.29 78.94,33.53 B12.2
GPB4  (via drill 0.3)
  Top 0.203: v49.28,57.4 v31.09,57.4 | v66.14,60.45 67.97,58.62 68.58,58.62 69.9,59.94 69.9,60.15 71.53,61.77 88.9,61.77 91.64,59.03 91.64,58.73 92.25,58.12 92.96,58.12 93.88,59.03 93.88,59.33 97.74,63.2 111.76,63.2 115.21,59.74 115.21,13.92 111.66,10.36 102.72,10.36 100.89,12.19 100.89,14.43 B13.2
  Bottom 0.203: v31.09,57.4 29.26,57.4 27.43,55.58 27.43,52.83 IC4.5 | v49.28,57.4 49.28,58.32 51.61,60.66 60.45,60.66 60.66,60.45 v66.14,60.45
GPB5  (via drill 0.3)
  Top 0.203: v28.55,54.05 31.8,54.05 32.21,53.65 v35.15,53.65 | v37.29,53.34 37.29,53.14 39.42,51 42.98,51 43.28,50.7 43.28,49.78 42.57,49.07 42.57,46.84 44.6,44.81 v47.45,44.81 | v61.57,33.53 61.57,31.8 66.65,26.72 v68.78,26.72 | v86.06,32.92 86.87,32.11 v97.23,32.11
  Bottom 0.203: v28.55,54.05 28.04,53.54 28.04,52.83 IC4.6 | v35.15,53.65 36.98,53.65 v37.29,53.34 | v47.45,44.81 47.45,44.5 49.28,42.67 49.28,41.45 56.08,34.65 59.54,34.65 60.66,33.53 v61.57,33.53 | v68.78,26.72 69.09,26.72 74.78,32.41 85.55,32.41 v86.06,32.92 | v97.23,32.11 98.25,32.11 98.55,32.41 99.77,32.41 100.79,33.43 B14.2
GPB6
  Bottom 0.203: IC4.7 28.65,51.92 30.18,50.39 39.42,50.39 41.45,52.43 B15.2
GPB7
  Bottom 0.203: IC4.8 29.36,52.73 29.36,51.92 30.48,50.8 36.27,50.8 39.12,53.65 52.83,53.65 53.95,52.53 B16.2
I2C_SCL  (via drill 0.3)
  Top 0.203: v31.29,51.41 30.28,51.41 18.8,62.89 JP4.2 | v47.95,29.97 47.95,31.29 51.1,34.44 51.1,35.15 51.71,35.76 58.32,35.76 62.99,40.44 62.99,41.15 68.78,46.94 68.78,49.58 69.49,50.29 v69.49,51.41 | v71.73,66.45 68.89,66.45 68.28,65.84 68.28,65.43 | v68.28,59.23 68.28,65.43 | 68.28,65.43 v65.13,65.43
  Bottom 0.203: R2.1 20.32,63.09 20.32,64.72 18.8,66.24 JP4.2 19.2,65.94 20.83,67.56 63.8,67.56 65.13,66.24 v65.13,65.43 | v31.29,51.41 31.8,51.92 31.8,52.73 IC4.12 | v47.95,29.97 46.33,28.35 46.33,25.3 IC3.26 | SERIAL1.4 81.18,47.35 81.18,47.75 79.15,49.78 78.54,49.78 78.44,49.68 71.22,49.68 v69.49,51.41 66.45,54.46 66.45,58.12 66.75,58.42 67.16,58.42 67.97,59.23 v68.28,59.23 | v71.73,66.45 72.24,65.94 73.36,65.94 74.27,66.85 74.27,68.28 IC2.12
I2C_SDA  (via drill 0.3)
  Top 0.203: v32.51,54.25 32.51,55.07 32.46,55.12 | 32.46,55.12 21.34,66.24 JP4.1 | v46.43,29.36 46.43,30.38 50.7,34.65 50.7,35.36 51.51,36.17 58.12,36.17 62.59,40.64 62.59,41.76 v65.33,44.5 65.23,44.5 64.01,45.72 64.01,53.65 62.28,55.37 61.16,55.37 60.45,56.08 | v65.73,61.87 65.73,61.57 62.99,58.83 62.99,58.62 62.28,57.91 61.16,57.91 60.45,57.2 60.45,56.08 | 60.45,56.08 37.9,56.08 36.98,55.17 32.51,55.17 32.46,55.12
  Bottom 0.203: R1.1 22.76,63.09 22.76,64.82 21.34,66.24 JP4.1 | v32.51,54.25 32.51,52.83 IC4.13 | v46.43,29.36 45.72,28.65 45.72,25.3 IC3.27 | v65.33,44.5 65.33,45.31 66.34,46.33 70.61,46.33 71.12,45.82 75.49,45.82 75.69,46.02 79.96,46.02 81.18,44.81 SERIAL1.3 | v65.73,61.87 65.73,65.73 65.63,65.84 65.63,69.9 66.95,71.22 74.27,71.22 74.88,70.61 74.88,68.38 IC2.13
L0
  Top 0.203: 19.76,13.77 20.42,14.43 B1.L1 | 19.76,13.77 19.71,13.72 19.71,11.07 R37.1 | 19.76,13.77 19.1,14.43 18.59,14.43 B1.L2
L1
  Top 0.203: R36.1 32.82,11.18 32.82,14.33 32.92,14.43 B2.L1 32.82,14.43 31.09,14.43 B2.L2
L2
  Top 0.203: R35.1 45.41,11.18 45.41,14.43 B3.L1 45.31,14.43 43.59,14.43 B3.L2
L3
  Top 0.203: R34.1 57.81,11.18 57.81,14.33 57.91,14.43 B4.L1 57.81,14.43 56.08,14.43 B4.L2
L4
  Top 0.203: R33.1 70.31,11.18 70.31,14.33 70.41,14.43 B5.L1 70.31,14.43 68.58,14.43 B5.L2
L5
  Top 0.203: R32.1 82.7,11.18 82.7,14.22 82.91,14.43 B6.L1 82.8,14.43 81.08,14.43 B6.L2
L6
  Top 0.203: R31.1 20.22,29.87 20.22,33.22 20.42,33.43 B7.L1 20.32,33.43 18.59,33.43 B7.L2
L7
  Top 0.203: R30.1 35.76,29.36 35.76,30.68 33.02,33.43 B8.L1 32.92,33.53 31.09,33.53 B8.L2
L8  (via drill 0.3)
  Top 0.203: v44.3,31.7 45.31,30.68 45.31,29.67 R29.1
  Bottom 0.203: v44.3,31.7 44.3,32.72 44.25,32.77 | 44.25,32.77 43.59,33.43 B9.L2 | 44.25,32.77 44.91,33.43 45.41,33.43 B9.L1
L9  (via drill 0.3)
  Top 0.203: v56.9,27.74 57.2,27.74 57.71,28.25 57.71,29.67 R28.1 | v58.73,27.74 58.73,28.04 59.03,28.35 59.03,32.41 58.01,33.43 B10.L1 57.91,33.53 56.08,33.53 B10.L2
  Bottom 0.203: v58.73,27.74 v56.9,27.74
L10
  Top 0.203: R27.1 70.71,29.77 70.71,33.22 70.51,33.43 B11.L1 70.41,33.53 68.58,33.53 B11.L2
L11
  Top 0.203: 82.45,32.97 82.91,33.43 B12.L1 | 82.45,32.97 82.4,32.92 82.4,29.36 R26.1 | 82.45,32.97 81.99,33.43 81.08,33.43 B12.L2
L12
  Top 0.203: R25.1 105.05,11.28 105.05,14.33 B13.L1 104.85,14.53 102.92,14.53 B13.L2
L13
  Top 0.203: R24.1 105.87,30.28 105.87,32.51 104.95,33.43 B14.L1 104.85,33.53 102.92,33.53 B14.L2
L14
  Top 0.203: R23.1 45.72,48.87 45.72,52.22 45.52,52.43 B15.L1 45.41,52.53 43.59,52.53 B15.L2
L15
  Top 0.203: 57.45,51.97 57.91,52.43 B16.L1 | 57.45,51.97 57.4,51.92 57.4,48.87 R22.1 | 57.45,51.97 57,52.43 56.08,52.43 B16.L2
N$1
  Bottom 0.305: K1.S1 94.89,13.61 95.91,14.63 95.91,22.15 96.32,22.55 96.93,22.55 97.74,21.74 97.74,21.03 100.69,18.09 108.71,18.09 110.64,20.02 110.64,22.15 111.76,23.27 112.27,23.27 115.72,26.72 115.72,42.47 111.76,46.43 X1.23
N$2  (via drill 0.3)
  Top 0.203: v52.83,32.11 52.83,31.29 55.58,28.55 v57.1,28.55 | v62.18,42.27 62.18,42.06 57.1,36.98 47.45,36.98 46.63,36.17 v35.46,36.17 | v34.65,32.92 34.65,32.41 37.49,29.57 37.49,29.36 R30.2
  Bottom 0.203: v52.83,32.11 52.83,31.09 IC3.13 | v57.1,28.55 67.06,28.55 71.63,33.12 71.63,33.93 66.14,39.42 64.01,39.42 62.18,41.25 v62.18,42.27 | v35.46,36.17 35.46,35.46 35.66,35.26 35.66,33.93 v34.65,32.92
N$3  (via drill 0.3)
  Top 0.203: v13.21,40.74 13.21,39.62 11.99,38.41 10.87,38.41 9.45,36.98 9.45,36.68 JP5.4 | v23.47,47.75 26.31,47.75 29.36,50.8 33.22,50.8 38.1,55.68 60.15,55.68 JP3.4
  Bottom 0.203: v13.21,40.74 17.17,44.7 20.42,44.7 v23.47,47.75
N$4
  Bottom 0.203: K1.16 88.9,10.16 88.9,55.58 91.34,58.01 91.34,59.03 92.56,60.25 93.67,60.25 IC1.18
N$5
  Bottom 0.203: IC2.1 67.26,68.28 67.26,65.63 69.29,63.6 79.86,63.6 83.11,60.35 83.62,60.35 IC1.1
N$6  (via drill 0.3)
  Top 0.305: v101.7,25.91 95.91,20.12 94.89,20.12 K2.S1 | v111.56,31.39 112.06,31.39 113.39,32.72 v113.39,42.06
  Bottom 0.305: v101.7,25.91 104.95,25.91 109.22,30.18 110.34,30.18 v111.56,31.39 | v113.39,42.06 111.76,43.69 X1.22
N$7
  Bottom 0.203: R4.1 13.31,38.91 12.19,38.91 11.48,39.62 U$7.A2
N$8
  Top 0.203: JP3.5 60.45,50.29 60.45,48.36 56.9,44.81 54.05,44.81 46.53,37.29 16.15,37.29 14.73,35.87 10.87,35.87 9.45,34.44 9.45,34.14 JP5.5
N$9  (via drill 0.3)
  Top 0.203: v93.27,49.38 91.54,47.65 v91.54,46.53 | v89.51,17.27 87.27,15.04 K2.16
  Bottom 0.203: v93.27,49.38 93.47,49.58 93.47,55.07 95.71,57.3 95.71,60.15 94.28,61.57 93.78,61.57 IC1.17 | v91.54,46.53 91.54,19.3 v89.51,17.27
N$10
  Bottom 0.305: K3.S1 94.89,26.62 102.92,26.62 109.22,32.92 110.34,32.92 111.76,34.34 112.27,34.34 113.39,35.46 113.39,39.32 111.76,40.95 X1.21
N$11
  Bottom 0.203: R3.1 13.31,35.26 12.09,35.26 11.48,34.65 U$7.A3
N$13
  Bottom 0.203: IC1.16 93.67,62.79 92.86,62.79 88.49,58.42 88.49,22.76 87.27,21.54 K3.16
N$14
  Bottom 0.305: X1.20 108.92,38.2 107.8,37.08 100.18,37.08 96.22,33.12 94.89,33.12 K4.S1
N$17  (via drill 0.3)
  Top 0.203: v89.41,60.35 89.41,58.73 90.93,57.2 v91.44,57.2 | v89.51,29.87 89.1,29.87 87.27,28.04 K4.16
  Bottom 0.203: v89.41,60.35 93.17,64.11 93.67,64.11 IC1.15 | v91.44,57.2 91.44,49.78 89.51,47.85 v89.51,29.87
N$18  (via drill 0.3)
  Top 0.305: v107.29,38.2 109.53,38.2 111.76,35.97 X1.19
  Bottom 0.305: v107.29,38.2 99.87,38.2 98.35,36.68 93.37,36.68 92.96,37.08 92.96,37.69 94.79,39.52 K5.S1
N$19  (via drill 0.3)
  Top 0.203: v47.95,27.94 29.36,27.94 25.6,24.18 23.77,24.18 18.49,29.46 18.49,29.77 R31.2
  Bottom 0.203: v47.95,27.94 48.26,27.94 50.39,30.07 51.61,30.07 52.12,30.58 52.12,30.99 IC3.12
N$21  (via drill 0.3)
  Top 0.203: v94.18,54.86 90.02,54.86 88.09,52.93 88.09,52.12 86.77,50.8 85.24,50.8 84.94,50.49 84.94,48.56 86.26,47.24 86.26,45.31 v86.36,45.21 | v86.36,41.66 86.36,41.35 86.26,41.25 86.26,35.46 87.17,34.54 K5.16
  Bottom 0.203: v94.18,54.86 96.11,56.79 96.11,63.6 94.39,65.33 93.78,65.33 IC1.14 | v86.36,41.66 v86.36,45.21
N$22
  Top 0.305: K6.S1 94.89,46.02 96.42,46.02 100.79,41.66 108.31,41.66 109.22,40.74 110.34,40.74 111.76,39.32 112.27,39.32 112.88,38.71 112.88,33.83 111.76,32.72 X1.18
N$23  (via drill 0.3)
  Top 0.203: v51.61,32.11 51.61,31.8 v56.29,27.13 | v60.15,22.05 62.38,22.05 64.62,19.81 v67.06,19.81 | v72.85,16.76 78.44,11.18 80.97,11.18 R32.2
  Bottom 0.203: v51.61,32.11 51.51,32 51.51,31.09 IC3.11 | v56.29,27.13 60.15,23.27 v60.15,22.05 | v67.06,19.81 69.09,19.81 72.14,16.76 v72.85,16.76
N$25  (via drill 0.3)
  Top 0.203: v93.67,37.39 90.83,37.39 87.27,40.95 K6.16
  Bottom 0.203: v93.67,37.39 93.98,37.39 96.52,39.93 96.52,64.41 94.28,66.65 93.78,66.65 IC1.13
N$26  (via drill 0.3)
  Top 0.305: v114.61,32.82 114.61,42.57 112.27,44.91 111.66,44.91 110.34,46.23 109.22,46.23 108.1,47.35 108.1,50.49 99.57,59.03 94.89,59.03 K7.S1
  Bottom 0.305: v114.61,32.82 111.76,29.97 X1.17
N$29
  Bottom 0.203: IC1.12 93.67,67.87 93.17,67.87 88.49,63.2 88.49,59.03 87.68,58.22 87.68,54.46 87.27,54.05 K7.16
N$30  (via drill 0.3)
  Top 0.305: v104.65,42.37 104.65,47.45 99.57,52.53 94.89,52.53 K8.S1 | v106.58,40.44 106.58,37.8 109.12,35.26 109.63,35.26 110.64,34.24 110.64,28.35 111.76,27.23 X1.16
  Bottom 0.305: v106.58,40.44 v104.65,42.37
N$31  (via drill 0.3)
  Top 0.203: v50.8,32.11 50.8,30.18 54.15,26.82 54.15,26.52 56.59,24.08 v71.32,24.08 | v73.46,12.8 70.92,10.26 69.39,10.26 68.58,11.07 R33.2
  Bottom 0.203: v50.8,32.11 50.8,31.09 IC3.10 | v71.32,24.08 74.88,20.52 74.88,14.22 v73.46,12.8
N$33  (via drill 0.3)
  Top 0.203: v97.13,51.82 95.3,51.82 93.47,49.99 89.71,49.99 87.27,47.55 K8.16
  Bottom 0.203: v97.13,51.82 97.13,66.34 94.28,69.19 93.78,69.19 IC1.11
N$34
  Bottom 0.203: IC2.2 67.87,68.28 67.87,65.63 69.49,64.01 80.67,64.01 83.01,61.67 83.62,61.67 IC1.2
N$35
  Bottom 0.203: IC2.3 68.48,68.28 68.48,65.63 69.7,64.41 81.58,64.41 83.11,62.89 83.62,62.89 IC1.3
N$36  (via drill 0.3)
  Top 0.203: v69.19,65.84 70.31,64.72 v82.19,64.72
  Bottom 0.203: v69.19,65.84 69.19,68.28 IC2.4 | v82.19,64.72 83.11,64.72 83.62,64.21 IC1.4
N$37  (via drill 0.3)
  Top 0.203: v70.1,65.84 81.89,65.84 v82.09,65.63
  Bottom 0.203: v70.1,65.84 69.8,66.14 69.8,68.28 IC2.5 | v82.09,65.63 83.41,65.63 83.62,65.43 IC1.5
N$38
  Bottom 0.203: IC2.6 70.51,68.28 70.51,66.34 70.71,66.14 70.71,65.94 71.53,65.13 80.67,65.13 82.19,66.65 83.62,66.65 IC1.6
N$39
  Bottom 0.203: IC2.7 71.12,68.28 71.12,66.14 71.73,65.53 80.47,65.53 82.8,67.87 83.62,67.87 IC1.7
N$40  (via drill 0.3)
  Top 0.203: v69.29,62.99 85.75,62.99 v85.85,63.09
  Bottom 0.203: v69.29,62.99 66.85,65.43 66.85,66.24 66.65,66.45 66.65,69.29 66.85,69.49 71.32,69.49 71.63,69.19 71.63,68.38 IC2.8 | v85.85,63.09 85.85,70.1 84.84,71.12 82.5,71.12 82.3,70.92 82.3,70 83.01,69.29 83.62,69.29 IC1.8
N$45
  Top 0.203: JP3.6 57.1,44.4 54.25,44.4 46.74,36.88 16.36,36.88 11.07,31.6 9.45,31.6 JP5.6
N$47
  Bottom 0.203: D7.1 68.58,9.35 69.39,9.35 69.7,9.04 R13.2 69.8,9.04 71.73,9.04 71.83,9.14 OK1.3
N$48
  Bottom 0.203: D8.1 68.07,4.27 69.7,4.27 69.8,4.17 R14.2 69.9,4.06 71.83,4.06 OK1.1
N$49  (via drill 0.3)
  Top 0.203: v68.68,8.33 69.9,8.33 72.64,11.07 v73.86,11.07 | v107.8,21.34 107.49,21.34 101.8,15.65 98.45,15.65 93.47,10.67 93.47,8.03 92.96,7.52 74.88,7.52 v73.97,8.43
  Bottom 0.203: v68.68,8.33 68.07,7.72 68.07,6.71 D8.2 | v73.86,11.07 73.86,8.64 73.81,8.59 | 73.81,8.59 71.93,6.71 OK1.2 | X1.10 109.22,44.7 111.86,42.06 112.27,42.06 115.21,39.12 115.21,29.06 111.66,25.5 111.25,25.5 110.34,24.59 110.34,22.55 109.12,21.34 v107.8,21.34 | 73.81,8.59 v73.97,8.43
N$50
  Bottom 0.203: D6.1 53.03,4.27 54.46,4.27 R15.2 54.56,4.17 56.39,4.17 OK2.1
N$51  (via drill 0.3)
  Top 0.203: v100.99,56.59 v81.48,56.59
  Bottom 0.203: v81.48,56.59 75.18,56.59 74.68,56.08 72.95,56.08 71.73,57.3 71.73,61.06 IC2.21 | v100.99,56.59 101.7,56.59 109.32,48.97 110.44,48.97 111.86,47.55 112.27,47.55 116.23,43.59 116.23,14.94 105.05,3.76 81.79,3.76 81.48,4.06 OK1.8
N$52
  Bottom 0.203: D5.1 53.03,9.35 54.15,9.35 54.46,9.04 R16.2 54.56,9.04 56.29,9.04 56.39,9.14 OK2.3
N$53
  Bottom 0.203: D4.1 37.59,4.27 38.91,4.27 39.01,4.17 R17.2 39.12,4.06 40.95,4.06 OK3.1
N$54
  Bottom 0.203: D3.1 37.59,9.35 38.91,9.35 39.01,9.25 R18.2 39.12,9.14 40.95,9.14 OK3.3
N$55  (via drill 0.3)
  Top 0.203: v42.57,6.81 41.86,7.52 v38,7.52 31.5,7.52 25.91,13.11 v25.91,19.51 | v25.3,28.14 25.3,33.33 27.53,35.56 50.29,35.56 51.31,36.58 57.61,36.58 v61.77,40.74 | v70.81,47.65 74.17,47.65 76.71,50.19 78.94,50.19 84.23,55.47 94.59,55.47 v95.91,54.15 | v95.91,40.23 96.11,40.23 101.7,34.65 108.71,34.65 109.22,34.14 X1.6
  Bottom 0.203: v38,7.52 37.59,7.11 37.59,6.71 D4.2 | v42.57,6.81 41.15,6.81 41.05,6.71 OK3.2 | v25.91,19.51 25.91,20.42 25.3,21.03 v25.3,28.14 | v61.77,40.74 61.77,41.76 61.57,41.96 61.57,42.77 66.45,47.65 v70.81,47.65 | v95.91,40.23 v95.91,54.15
N$56
  Bottom 0.203: D2.1 21.54,4.27 23.27,4.27 23.37,4.17 R19.2 23.47,4.06 25.6,4.06 OK4.1
N$57
  Bottom 0.203: D1.1 21.54,9.35 23.37,9.35 23.47,9.25 R20.2 23.57,9.14 25.6,9.14 OK4.3
N$58  (via drill 0.3)
  Top 0.203: v49.99,32.11 49.99,30.38 53.75,26.62 53.75,26.01 v55.68,24.08 | v56.9,18.9 56.9,17.17 59.13,14.94 59.13,10.97 58.42,10.26 56.9,10.26 56.08,11.07 R34.2
  Bottom 0.203: v49.99,32.11 50.09,32 50.09,31.09 IC3.9 | v55.68,24.08 57,24.08 59.13,21.95 59.13,21.13 v56.9,18.9
N$59  (via drill 0.3)
  Top 0.203: v46.94,26.72 43.59,26.72 43.38,26.92 42.77,26.92 42.47,26.62 42.47,26.01 45.21,23.27 46.23,23.27 v46.63,22.86 | v46.74,15.95 46.74,10.97 46.02,10.26 44.5,10.26 43.69,11.07 R35.2
  Bottom 0.203: v46.94,26.72 46.94,27.84 47.65,28.55 48.26,28.55 49.48,29.77 49.48,30.99 IC3.8 | v46.63,22.86 46.63,18.69 46.74,18.59 v46.74,15.95
N$60
  Bottom 0.203: D7.2 68.58,11.68 71.83,11.68 OK1.4 71.93,11.68 76.61,11.68 80.26,8.03 82.6,8.03 82.8,8.23 82.8,10.06 82.3,10.57 80.26,10.57 80.06,10.77 80.06,12.6 80.37,12.9 82.5,12.9 84.84,10.57 84.84,8.64 86.56,6.91 87.88,6.91 89.51,8.53 89.51,9.14 93.67,13.31 93.67,34.65 95.2,36.17 98.55,36.17 99.97,37.59 107.59,37.59 108.1,38.1 108.1,41.15 109.22,42.27 X1.9
N$61  (via drill 0.3)
  Top 0.203: v53.44,7.52 57.51,7.52 v57.81,7.82 60.66,7.82 60.86,8.03 68.07,8.03 68.38,7.72 69.9,7.72 72.03,9.86 83.52,9.86 86.26,12.6 86.26,15.24 90.12,19.1 90.73,19.1 91.64,20.02 91.64,21.74 94.28,24.38 95.71,24.38 v98.65,27.33
  Bottom 0.203: v53.44,7.52 53.03,7.11 53.03,6.71 D6.2 | v57.81,7.82 57.61,7.82 56.49,6.71 OK2.2 | v98.65,27.33 100.89,27.33 109.32,35.76 110.54,35.76 111.86,37.08 112.17,37.08 112.88,37.8 112.88,38.61 111.96,39.52 109.22,39.52 X1.8
N$62  (via drill 0.3)
  Top 0.203: v70,19.81 v66.04,15.85 | v73.25,20.32 74.27,20.32 77.52,23.57 80.47,23.57 87.38,30.48 v94.28,30.48
  Bottom 0.203: D5.2 53.03,11.68 56.39,11.68 OK2.4 56.49,11.79 60.25,11.79 64.31,15.85 v66.04,15.85 | v70,19.81 72.75,19.81 v73.25,20.32 | v94.28,30.48 100.38,36.58 109.02,36.58 109.22,36.78 X1.7
N$63  (via drill 0.3)
  Top 0.203: v45.41,55.07 38.1,55.07 36.68,53.65 v36.68,45.31 | v33.83,24.08 v36.88,27.13 | v35.97,13.11 35.97,10.97 v36.47,10.46
  Bottom 0.203: v45.41,55.07 46.74,56.39 46.74,57.3 53.44,64.01 61.77,64.01 64.62,61.16 67.16,61.16 IC2.28 | v36.68,45.31 36.68,37.08 36.88,36.88 v36.88,27.13 | v33.83,24.08 33.83,22.25 34.14,21.95 34.14,18.69 34.04,18.59 34.04,15.04 v35.97,13.11 | v36.47,10.46 35.15,9.14 OK4.6
N$64  (via drill 0.3)
  Top 0.203: v43.69,9.04 58.01,9.04 58.22,8.84 59.33,8.84 v59.54,9.04 | v61.16,7.42 68.07,7.42 68.17,7.32 70.1,7.32 72.24,9.45 84.33,9.45 89.51,14.63 89.51,15.34 92.66,18.49 103.43,18.49 107.7,22.76 107.7,29.77 109.22,31.29 X1.5
  Bottom 0.203: D3.2 37.59,11.68 40.95,11.68 OK3.4 41.05,11.68 v43.69,9.04 | v61.16,7.42 v59.54,9.04
N$65  (via drill 0.3)
  Top 0.203: v94.28,24.99 88.09,24.99 79.96,16.87 v73.66,16.87 | v64.92,16.46 60.76,12.29 60.76,9.35 59.84,8.43 42.47,8.43 41.25,9.65 v30.28,9.65
  Bottom 0.203: 26.92,9.65 26.92,7.92 25.7,6.71 OK4.2 | 26.92,9.65 26.92,10.16 26.72,10.36 21.34,10.36 20.73,9.75 20.73,8.94 21.44,8.23 21.44,6.71 D2.2 | X1.4 108.31,28.55 104.75,24.99 v94.28,24.99 | v73.66,16.87 73.66,16.66 73.15,16.15 66.65,16.15 66.34,16.46 v64.92,16.46 | 26.92,9.65 v30.28,9.65
N$66  (via drill 0.3)
  Top 0.203: X1.3 109.22,24.59 108.1,23.47 108.1,22.55 101.6,16.05 92.46,16.05 91.34,14.94 91.34,13.21 87.48,9.35 84.84,9.35 84.53,9.04 72.44,9.04 70.21,6.81 43.48,6.81 41.25,9.04 v31.8,9.04
  Bottom 0.203: D1.2 21.54,11.68 25.6,11.68 OK4.4 25.7,11.68 29.16,11.68 v31.8,9.04
N$67  (via drill 0.3)
  Top 0.203: v48.77,29.97 49.78,29.97 51.51,28.25 51.51,27.64 51.21,27.33 42.57,27.33 40.23,24.99 v40.23,24.08 | v40.95,15.95 37.9,15.95 33.73,11.79 33.73,10.57 33.43,10.26 32,10.26 31.19,11.07 R36.2
  Bottom 0.203: v48.77,29.97 48.87,30.07 48.87,30.99 IC3.7 | v40.23,24.08 40.23,23.77 38.41,21.95 38.41,21.03 40.13,19.3 40.95,19.3 41.66,18.59 41.66,16.66 v40.95,15.95
N$68  (via drill 0.3)
  Top 0.203: v71.12,55.37 68.07,52.32 68.07,50.09 66.04,48.06 v66.04,45.11 | v71.93,26.21 v71.93,34.54
  Bottom 0.203: v71.12,55.37 71.12,61.06 IC2.22 | v66.04,45.11 67.46,45.11 71.93,40.64 v71.93,34.54 | v71.93,26.21 71.93,24.08 75.39,20.62 75.39,14.53 80.67,9.25 81.38,9.25 OK1.6
N$69  (via drill 0.3)
  Top 0.203: v70.51,59.84 76.71,59.84 80.67,55.88 100.79,55.88 107.59,49.07 107.59,45.21 109.32,43.48 110.44,43.48 111.25,42.67 113.69,42.67 114,42.37 v114,22.05
  Bottom 0.203: v70.51,59.84 70.51,61.06 IC2.23 | v114,22.05 102.41,10.46 98.04,10.46 92.86,5.28 75.39,5.28 73.05,2.95 67.16,2.95 66.04,4.06 OK2.8
N$70  (via drill 0.3)
  Top 0.203: v87.17,48.56 v85.55,50.19 | v85.85,21.34 85.85,12.8 83.31,10.26 73.46,10.26 v73.25,10.46
  Bottom 0.203: v85.55,50.19 75.39,50.19 69.8,55.78 69.8,61.06 IC2.24 | v87.17,48.56 87.38,48.56 88.09,47.85 88.09,23.57 v85.85,21.34 | v73.25,10.46 67.26,10.46 66.04,9.25 OK2.6
N$71  (via drill 0.3)
  Top 0.203: v70.1,52.73 70.1,50.29 69.19,49.38 v69.19,44.3 | v52.83,16.56 52.53,16.56 50.9,14.94 50.9,13.51 v52.12,12.29
  Bottom 0.203: v70.1,52.73 69.19,53.65 69.19,61.06 IC2.25 | v69.19,44.3 69.19,43.99 72.54,40.64 72.54,32.11 59.44,19 59.44,17.48 58.52,16.56 v52.83,16.56 | v52.12,12.29 52.12,10.97 51.51,10.36 49.48,10.36 49.17,10.06 49.17,5.49 50.49,4.17 OK3.8
N$72  (via drill 0.3)
  Top 0.203: v35.66,43.38 v42.67,50.39 | v36.58,18.9 36.58,17.48 37.49,16.56 47.04,16.56 50.09,13.51 50.09,12.09 v52.12,10.06
  Bottom 0.203: v42.67,50.39 57.4,50.39 59.13,52.12 59.13,53.34 61.16,55.37 62.28,55.37 65.73,58.83 66.95,58.83 68.38,60.25 68.38,61.06 IC2.26 | v35.66,43.38 35.66,36.88 36.07,36.47 36.07,33.43 32.61,29.97 31.6,29.97 31.39,29.77 31.39,27.43 34.65,24.18 34.65,20.83 v36.58,18.9 | v52.12,10.06 51.82,10.06 51,9.25 50.6,9.25 OK3.6
N$73  (via drill 0.3)
  Top 0.203: v66.75,62.99 56.49,62.99 54.97,61.47 v31.09,61.47
  Bottom 0.203: v66.75,62.99 67.77,61.98 67.77,61.16 IC2.27 | v31.09,61.47 31.09,61.16 18.49,48.56 18.49,45.31 18.29,45.11 14.53,45.11 9.86,40.44 8.84,40.44 2.13,33.73 2.13,10.57 9.75,2.95 33.93,2.95 35.05,4.06 OK4.8
N$74  (via drill 0.3)
  Top 0.203: v47.45,32.31 38.2,32.31 36.17,34.34 33.73,34.34 33.33,34.75 v27.64,34.75 | v26.11,35.05 26.11,34.75 24.08,32.72 v24.08,24.79 | v19,12.09 17.98,11.07 R37.2
  Bottom 0.203: v47.45,32.31 48.16,31.6 48.16,31.09 IC3.6 | v27.64,34.75 26.42,34.75 v26.11,35.05 | v24.08,24.79 24.08,16.56 19.61,12.09 v19,12.09
N$75  (via drill 0.3)
  Top 0.203: v53.34,24.18 52.02,25.5 v44.3,25.5 | v44.3,30.68 44.3,30.28 43.69,29.67 R29.2
  Bottom 0.203: v53.34,24.18 53.34,25.2 IC3.15 | v44.3,30.68 v44.3,25.5
N$76  (via drill 0.3)
  Top 0.203: v56.29,26.21 58.62,28.55 58.62,30.28 58.32,30.58 56.9,30.58 56.08,29.77 R28.2
  Bottom 0.203: v56.29,26.21 53.34,26.21 52.83,25.7 52.83,25.3 IC3.16
N$77  (via drill 0.3)
  Top 0.203: v52.53,24.08 53.14,23.47 v62.79,23.47 | v67.26,27.94 68.99,29.67 R27.2
  Bottom 0.203: v52.53,24.08 52.22,24.38 52.22,25.2 IC3.17 | v67.26,27.94 v62.79,23.47
N$78  (via drill 0.3)
  Top 0.203: v51.41,24.08 51.41,23.88 v49.17,21.64 | v72.44,20.42 76,23.98 80.16,23.98 83.92,27.74 83.92,29.26 R26.2
  Bottom 0.203: v51.41,24.08 51.41,25.2 IC3.18 | v49.17,21.64 49.17,15.14 51.31,13.01 60.05,13.01 66.45,19.41 66.45,20.12 66.75,20.42 v72.44,20.42
N$79  (via drill 0.3)
  Top 0.203: v54.76,26.82 55.98,25.6 76.3,25.6 76.5,25.81 v81.08,25.81 | v83.31,25.5 93.88,25.5 93.98,25.6 96.01,25.6 98.35,27.94 98.96,27.94 99.26,27.64 99.26,24.49 v96.62,21.84 | v102.51,12.19 103.43,11.28 R25.2
  Bottom 0.203: v54.76,26.82 52.02,26.82 50.9,25.7 50.9,25.3 IC3.19 | v81.08,25.81 83.01,25.81 v83.31,25.5 | v96.62,21.84 96.62,15.24 99.67,12.19 v102.51,12.19
N$80  (via drill 0.3)
  Top 0.203: v50.9,27.94 48.87,27.94 48.06,28.75 v42.67,28.75 | v50.29,46.63 v47.04,43.38 | v74.78,46.43 74.78,47.65 75.69,48.56 84.33,48.56 85.75,47.14 85.75,44.91 86.67,43.99 91.44,43.99 93.88,41.55 93.88,38.71 97.74,34.85 97.74,33.12 98.55,32.31 102.11,32.31 104.14,30.28 R24.2
  Bottom 0.203: v50.9,27.94 50.19,27.23 50.19,25.3 IC3.20 | v42.67,28.75 37.69,33.73 37.69,38.1 37.49,38.3 37.49,40.03 40.84,43.38 v47.04,43.38 | v50.29,46.63 64.21,46.63 66.45,48.87 71.73,48.87 73.56,47.04 73.56,46.74 73.86,46.43 v74.78,46.43
N$81  (via drill 0.3)
  Top 0.203: v49.17,26.21 47.35,26.21 47.24,26.11 43.28,26.11 v43.08,26.31 | v43.59,46.74 45.41,46.74 47.45,48.77 R23.2
  Bottom 0.203: v49.17,26.21 49.48,25.91 49.48,25.3 IC3.21 | v43.08,26.31 43.08,27.43 37.29,33.22 37.29,37.9 37.08,38.1 37.08,40.23 v43.59,46.74
N$82  (via drill 0.3)
  Top 0.203: v60.76,27.94 60.76,33.93 v60.96,34.14 | v56.59,45.41 56.59,46.43 58.93,48.77 R22.2
  Bottom 0.203: v60.76,27.94 60.76,21.74 60.45,21.44 59.84,21.44 59.54,21.74 59.54,22.15 57,24.69 55.37,24.69 54.15,23.47 50.09,23.47 48.97,24.59 48.97,25.2 IC3.22 | v60.96,34.14 60.96,38.61 59.13,40.44 59.13,42.88 v56.59,45.41
RES
  Top 0.203: RESETA.1 13.21,11.48 15.75,11.48 RESET.1
  Bottom 0.203: GND.RES 32.72,17.98 32,17.98 29.67,15.65 23.77,15.65 19.61,11.48 15.75,11.48 RESET.1
SDI_MOSI
  Top 0.203: JP6.2 98.96,31.09 98.96,31.29 95.71,34.54 95.71,36.27 93.47,38.51 93.47,41.35 91.24,43.59 86.46,43.59 85.14,44.91 85.14,45.21 84.33,46.02 77.42,46.02 76.2,47.24 SERIAL1.8
SDI_SCLK
  Top 0.203: JP6.1 101.5,30.99 100.79,30.99 99.47,29.67 96.01,29.67 93.98,31.7 86.36,31.7 78.64,39.42 76.5,39.42 75.89,40.03 75.89,44.5 76.1,44.7 SERIAL1.7
SLIDER_IN  (via drill 0.3)
  Top 0.203: v66.65,45.72 66.65,48.06 68.48,49.89 68.48,52.02 70.71,54.25 73.56,54.25 POT1.2A
  Bottom 0.203: C7.1 75.79,55.68 74.98,55.68 73.66,54.36 POT1.2A | 74.62,40.69 78.64,44.7 SERIAL1.5 | 74.62,40.69 74.57,40.64 74.57,33.53 61.98,20.93 61.98,16.97 58.42,13.41 51.51,13.41 50.6,14.33 50.6,17.98 GND.A0 | v66.65,45.72 69.6,45.72 74.62,40.69

## Text on the board
_tsilk: SCL SDA
_bsilk: SKAARHOJ 2015 | v04-15 | PCB-CMB-5-SHLD | GITHUB: SKAARHOJ-Open-Engineering | I2C PullUps